# EAGLE schematic system (EAGLE 7.4.0)
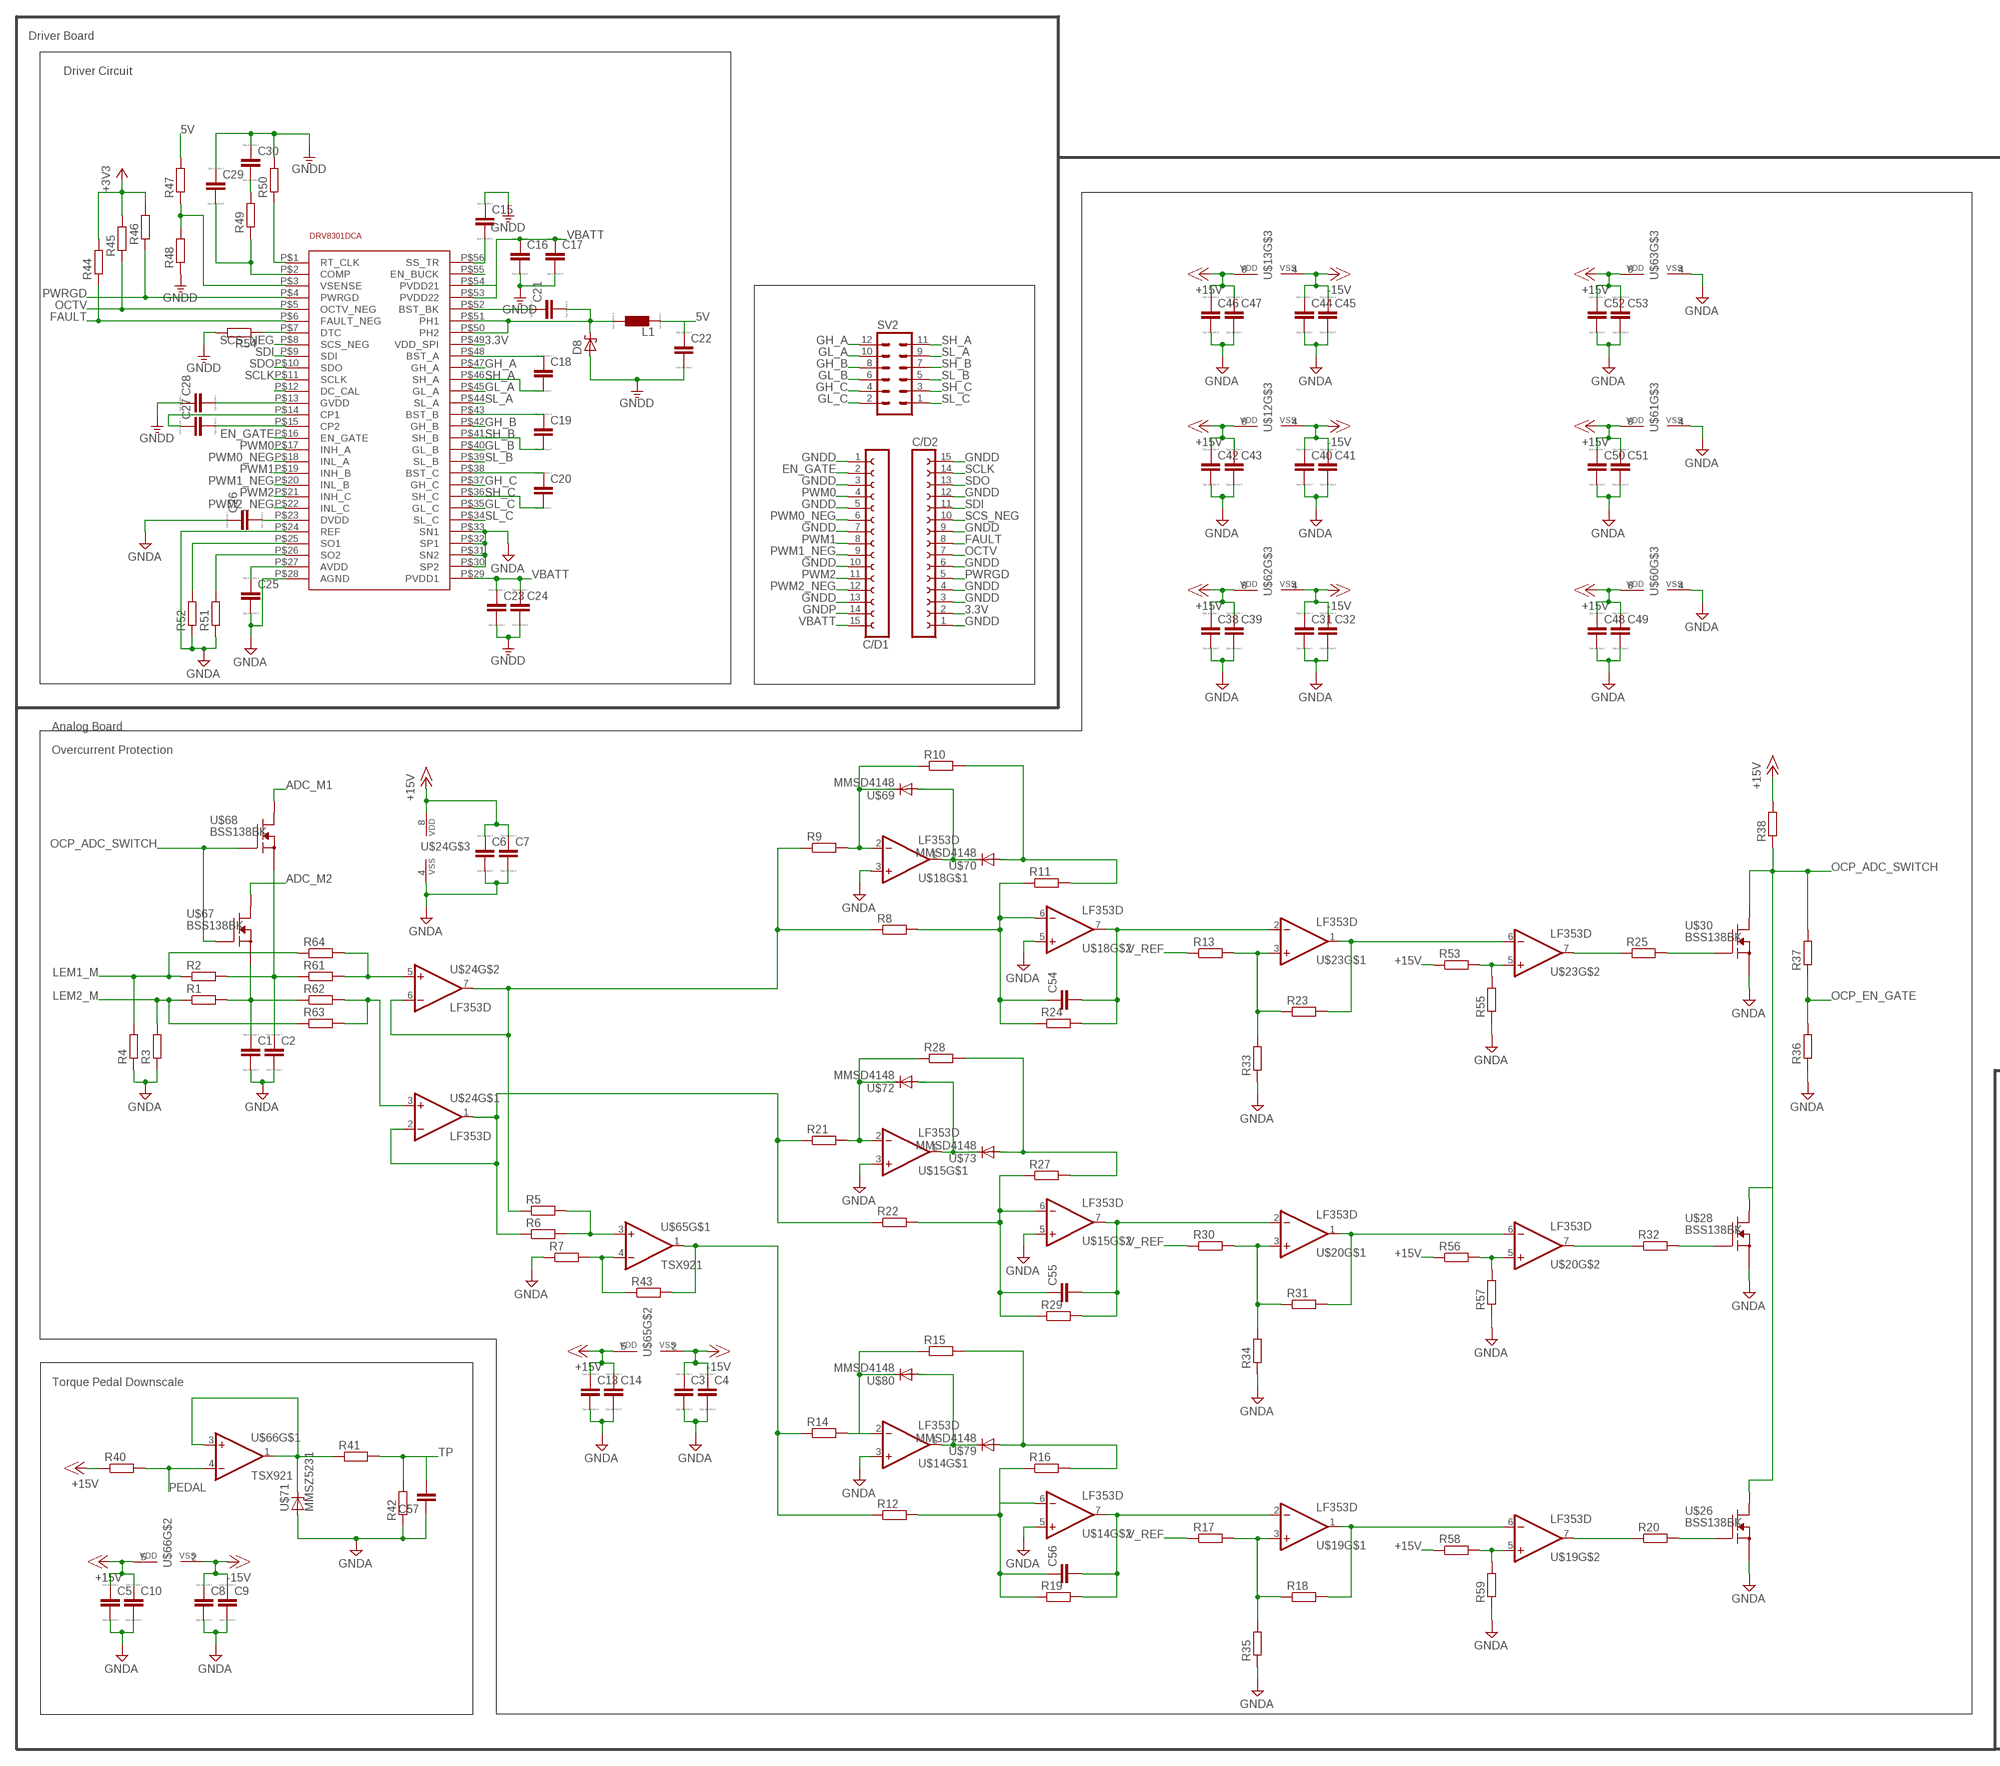
[diagram p0: schematic, sheet 1, part 1 of 2]
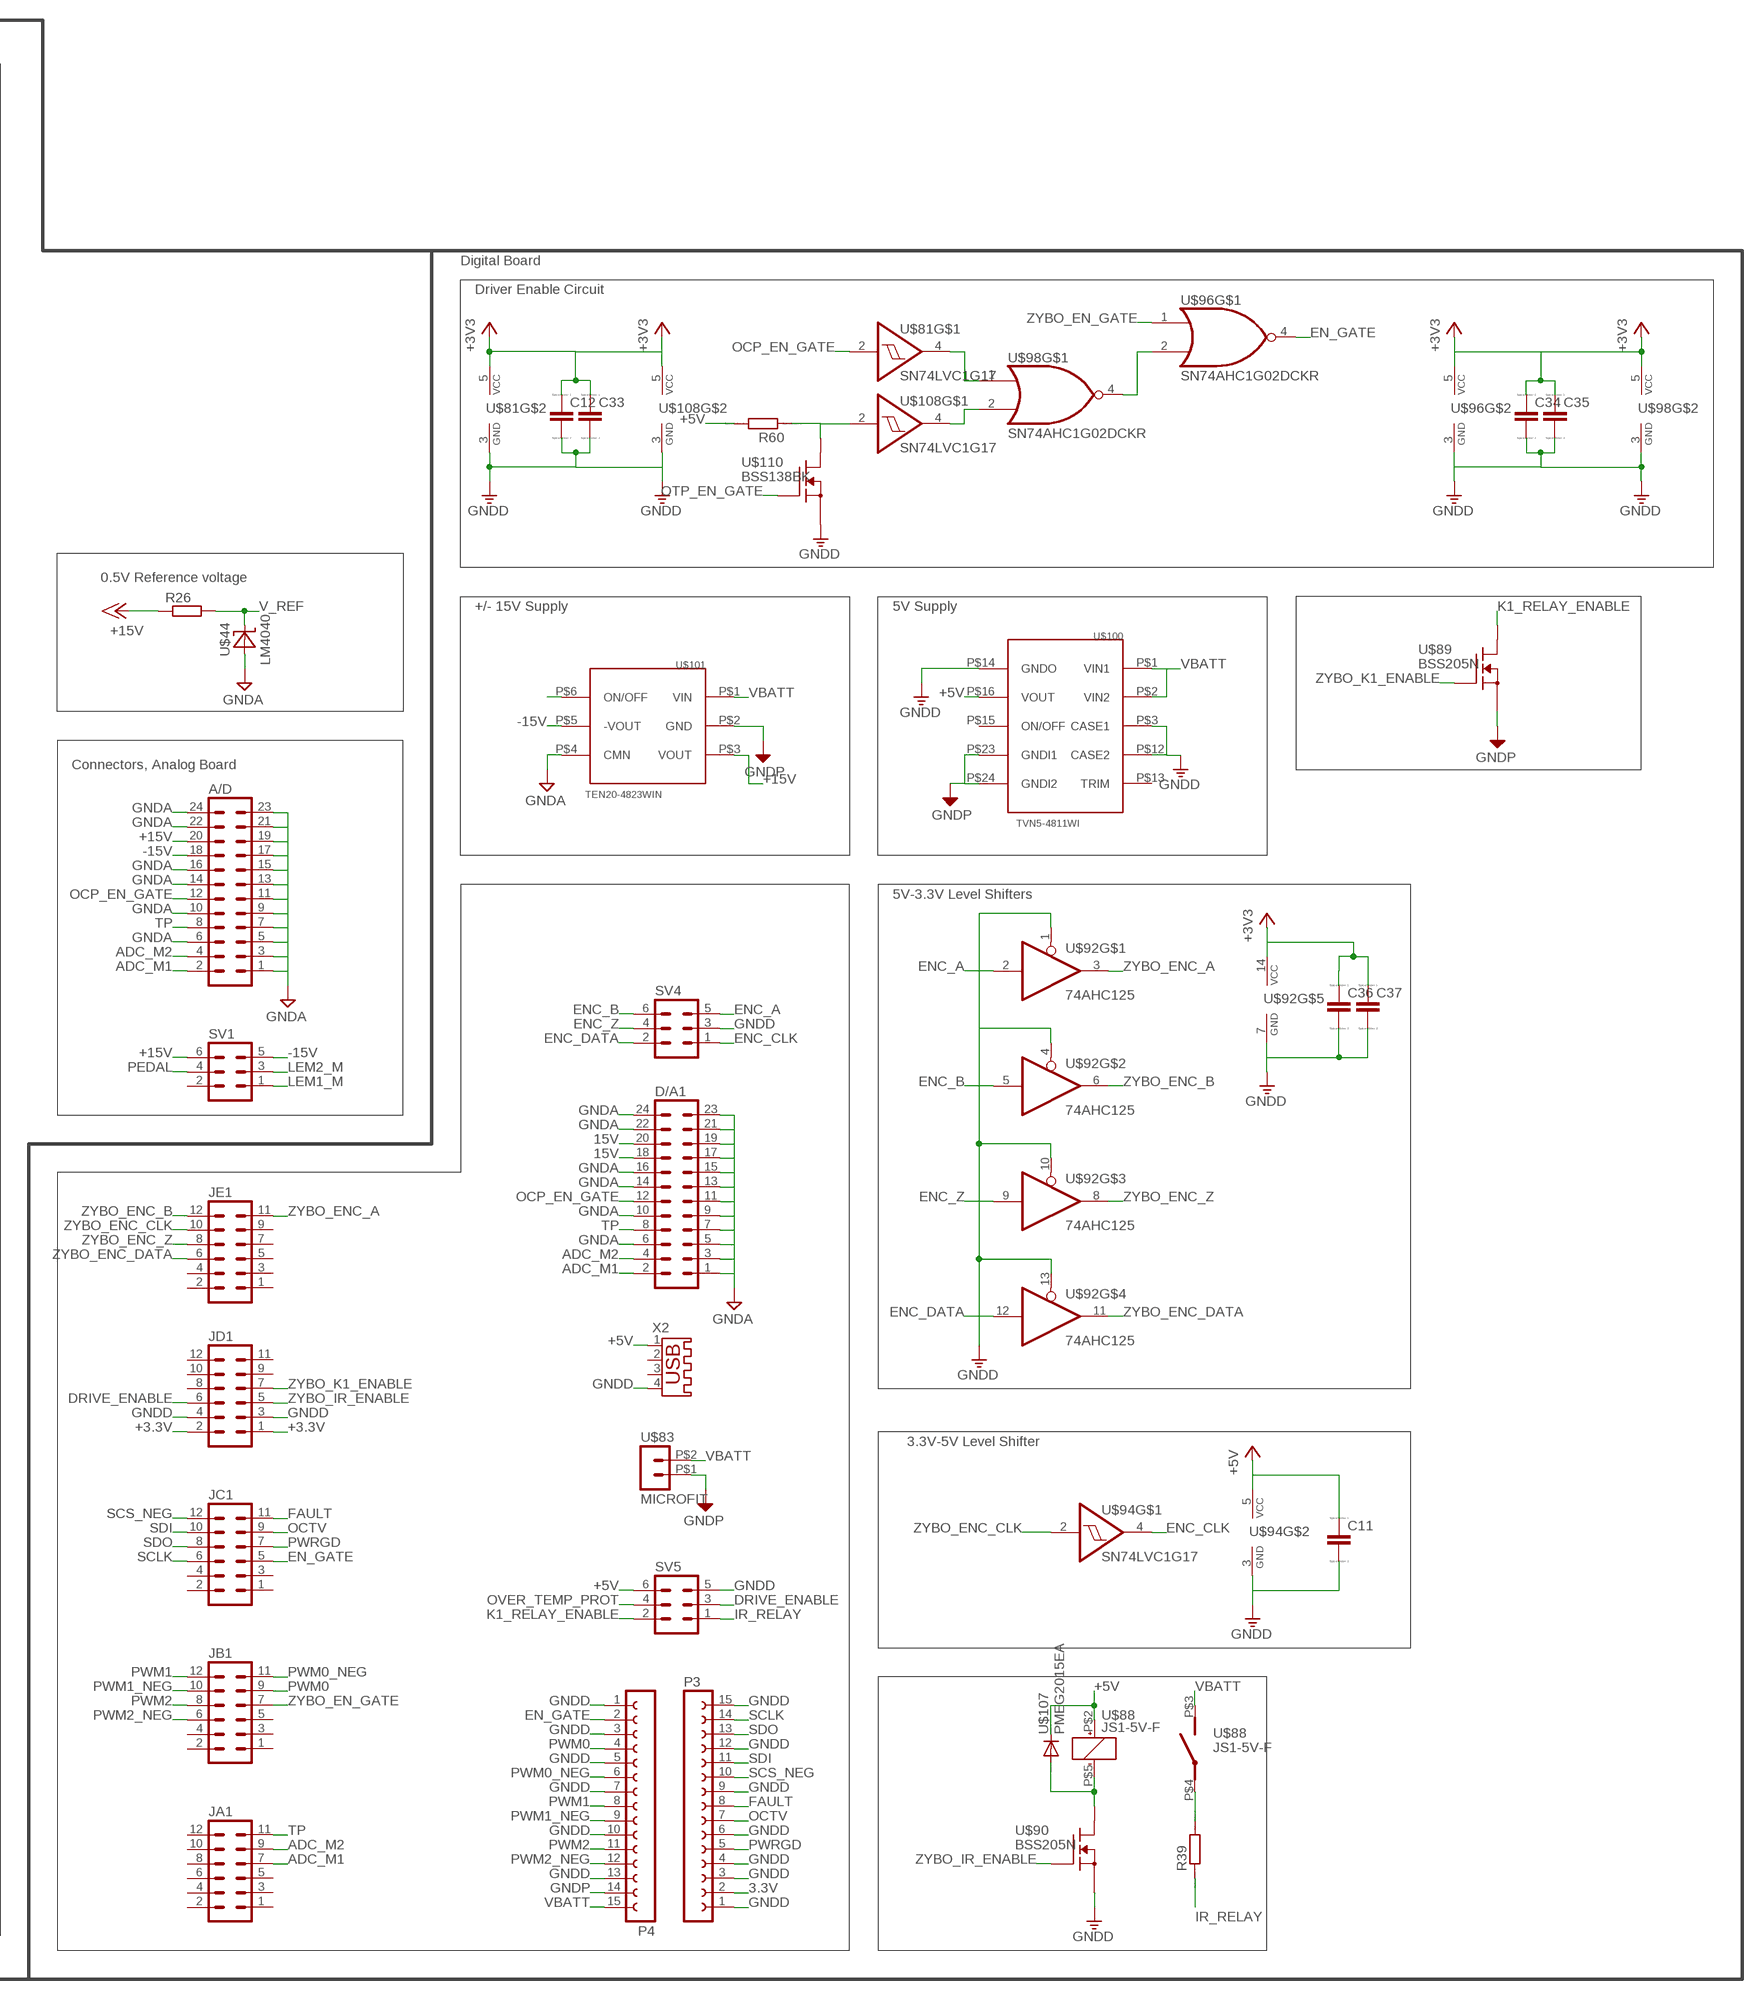
[diagram p1: schematic, sheet 1, part 2 of 2]

## Parts
A/D  MA12-2  [MA12-2]
C1  CC1206  [C1206]
C2  CC1206  [C1206]
C3  CC1206  [C1206]
C4  CC1206  [C1206]
C5  CC1206  [C1206]
C6  CC1206  [C1206]
C7  CC1206  [C1206]
C8  CC1206  [C1206]
C9  CC1206  [C1206]
C10  CC1206  [C1206]
C11  CC1206  [C1206]
C12  CC1206  [C1206]
C13  CC1206  [C1206]
C14  CC1206  [C1206]
C15  CC1206  [C1206]
C16  CC1206  [C1206]
C17  CC1206  [C1206]
C18  CC1206  [C1206]
C19  CC1206  [C1206]
C20  CC1206  [C1206]
C21  CC1206  [C1206]
C22  CC1206  [C1206]
C23  CC1206  [C1206]
C24  CC1206  [C1206]
C25  CC1206  [C1206]
C26  CC1206  [C1206]
C27  CC1206  [C1206]
C28  CC1206  [C1206]
C29  CC1206  [C1206]
C30  CC1206  [C1206]
C31  CC1206  [C1206]
C32  CC1206  [C1206]
C33  CC1206  [C1206]
C34  CC1206  [C1206]
C35  CC1206  [C1206]
C36  CC1206  [C1206]
C37  CC1206  [C1206]
C38  CC1206  [C1206]
C39  CC1206  [C1206]
C40  CC1206  [C1206]
C41  CC1206  [C1206]
C42  CC1206  [C1206]
C43  CC1206  [C1206]
C44  CC1206  [C1206]
C45  CC1206  [C1206]
C46  CC1206  [C1206]
C47  CC1206  [C1206]
C48  CC1206  [C1206]
C49  CC1206  [C1206]
C50  CC1206  [C1206]
C51  CC1206  [C1206]
C52  CC1206  [C1206]
C53  CC1206  [C1206]
C54  C-EUC0805  [C0805]
C55  C-EUC0805  [C0805]
C56  C-EUC0805  [C0805]
C57  C-EUC0805  [C0805]
C/D1  FE15-1  [FE15]
C/D2  FE15-1  [FE15]
D8  SCHOTTKY-DIODESMD  [SMB]
D/A1  MA12-2  [MA12-2]
JA1  MA06-2  [MA06-2]
JB1  MA06-2  [MA06-2]
JC1  MA06-2  [MA06-2]
JD1  MA06-2  [MA06-2]
JE1  MA06-2  [MA06-2]
L1  L  [L1812]
P3  FE15-1  [FE15]
P4  FE15-1  [FE15]
R1  R-EU_M0805  [M0805]
R2  R-EU_M0805  [M0805]
R3  R-EU_M0805  [M0805]
R4  R-EU_M0805  [M0805]
R5  R-EU_M0805  [M0805]
R6  R-EU_M0805  [M0805]
R7  R-EU_M0805  [M0805]
R8  R-EU_M0805  [M0805]
R9  R-EU_M0805  [M0805]
R10  R-EU_M0805  [M0805]
R11  R-EU_M0805  [M0805]
R12  R-EU_M0805  [M0805]
R13  R-EU_M0805  [M0805]
R14  R-EU_M0805  [M0805]
R15  R-EU_M0805  [M0805]
R16  R-EU_M0805  [M0805]
R17  R-EU_M0805  [M0805]
R18  R-EU_M0805  [M0805]
R19  R-EU_M0805  [M0805]
R20  R-EU_M0805  [M0805]
R21  R-EU_M0805  [M0805]
R22  R-EU_M0805  [M0805]
R23  R-EU_M0805  [M0805]
R24  R-EU_M0805  [M0805]
R25  R-EU_M0805  [M0805]
R26  R-EU_M0805  [M0805]
R27  R-EU_M0805  [M0805]
R28  R-EU_M0805  [M0805]
R29  R-EU_M0805  [M0805]
R30  R-EU_M0805  [M0805]
R31  R-EU_M0805  [M0805]
R32  R-EU_M0805  [M0805]
R33  R-EU_M0805  [M0805]
R34  R-EU_M0805  [M0805]
R35  R-EU_M0805  [M0805]
R36  R-EU_M0805  [M0805]
R37  R-EU_M0805  [M0805]
R38  R-EU_M0805  [M0805]
R39  RR1206  [R1206]
R40  R-EU_M0805  [M0805]
R41  R-EU_M0805  [M0805]
R42  R-EU_M0805  [M0805]
R43  R-EU_M0805  [M0805]
R44  R-EU_R1206  [R1206]
R45  R-EU_R1206  [R1206]
R46  R-EU_R1206  [R1206]
R47  R-EU_R1206  [R1206]
R48  R-EU_R1206  [R1206]
R49  R-EU_R1206  [R1206]
R50  R-EU_R1206  [R1206]
R51  R-EU_R1206  [R1206]
R52  R-EU_R1206  [R1206]
R53  R-EU_M0805  [M0805]
R54  R-EU_R1206  [R1206]
R55  R-EU_M0805  [M0805]
R56  R-EU_M0805  [M0805]
R57  R-EU_M0805  [M0805]
R58  R-EU_M0805  [M0805]
R59  R-EU_M0805  [M0805]
R60  RR1206  [R1206]
R61  R-EU_M0805  [M0805]
R62  R-EU_M0805  [M0805]
R63  R-EU_M0805  [M0805]
R64  R-EU_M0805  [M0805]
SV1  MA03-2  [MA03-2]
SV2  MA06-2  [MA06-2]
SV4  MA03-2  [MA03-2]
SV5  MA03-2  [MA03-2]
U$12  LF353D  [SO08]
U$13  LF353D  [SO08]
U$14  LF353D  [SO08]
U$15  LF353D  [SO08]
U$18  LF353D  [SO08]
U$19  LF353D  [SO08]
U$20  LF353D  [SO08]
U$23  LF353D  [SO08]
U$24  LF353D  [SO08]
U$26  BSS138BK  [SOT23]
U$28  BSS138BK  [SOT23]
U$29  DRV8301DCA  [HTSSOP-56]
U$30  BSS138BK  [SOT23]
U$44  LM4040  [SOT23]
U$60  LF353D  [SO08]
U$61  LF353D  [SO08]
U$62  LF353D  [SO08]
U$63  LF353D  [SO08]
U$65  TSX921  [SOT23-5]
U$66  TSX921  [SOT23-5]
U$67  BSS138BK  [SOT23]
U$68  BSS138BK  [SOT23]
U$69  MMSD4148  [SOD123]
U$70  MMSD4148  [SOD123]
U$71  MMSZ5231  [SOD123]
U$72  MMSD4148  [SOD123]
U$73  MMSD4148  [SOD123]
U$79  MMSD4148  [SOD123]
U$80  MMSD4148  [SOD123]
U$81  SN74LVC1G17  [SOT23-5L]
U$83  MICROFIT  [MICROFIT-3.0]
U$88  JS1-5V-F  [JS1-5V-F]
U$89  BSS205N  [SOT23]
U$90  BSS205N  [SOT23]
U$92  74AHC125  [SO14]
U$94  SN74LVC1G17  [SOT23-5L]
U$96  SN74AHC1G02DCKR  [SOT23-5]
U$98  SN74AHC1G02DCKR  [SOT23-5]
U$100  TVN5-4811WI  [DIP24]
U$101  TEN20-4823WIN  [TEN20-4823]
U$107  PMEG2015EA  [SOD323_ST]
U$108  SN74LVC1G17  [SOT23-5L]
U$110  BSS138BK  [SOT23]
X2  USB-A003  [USB-A003]

## Nets
3.3V: C/D2.2 P3.2 U$29.P$49(VDD_SPI)
5V: C22.1 L1.2 R47.2
15V: D/A1.18 D/A1.20
+3.3V: JD1.1 JD1.2
+3V3: C12.1 C33.1 C34.1 C35.1 C36.1 C37.1 R44.2 R45.2 R46.2 U$81.5(VCC) U$92.14(VCC) U$96.5(VCC) U$98.5(VCC) U$108.5(VCC)
+5V: C11.1 R60.2 SV5.6 U$88.P$2(+) U$94.5(VCC) U$100.P$16(VOUT) U$107.C X2.1
+15V: A/D.20 C5.1 C6.1 C7.1 C10.1 C13.1 C14.1 C38.1 C39.1 C42.1 C43.1 C46.1 C47.1 C48.1 C49.1 C50.1 C51.1 C52.1 C53.1 R26.1 R38.2 R40.1 R53.1 R56.1 R58.1 SV1.6 U$12.8(VDD) U$13.8(VDD) U$24.8(VDD) U$60.8(VDD) U$61.8(VDD) U$62.8(VDD) U$63.8(VDD) U$65.5(VDD) U$66.5(VDD) U$101.P$3(VOUT)
-15V: A/D.18 C3.1 C4.1 C8.1 C9.1 C31.1 C32.1 C40.1 C41.1 C44.1 C45.1 SV1.5 U$12.4(VSS) U$13.4(VSS) U$62.4(VSS) U$65.2(VSS) U$66.2(VSS) U$101.P$5(-VOUT)
ADC_M1: A/D.2 D/A1.2 JA1.7 U$68.3(D)
ADC_M2: A/D.4 D/A1.4 JA1.9 U$67.3(D)
DRIVE_ENABLE: JD1.6 SV5.3
EN_GATE: C/D1.2 JC1.5 P4.2 U$29.P$16(EN_GATE) U$96.4(O)
ENC_A: SV4.5 U$92.2(I)
ENC_B: SV4.6 U$92.5(I)
ENC_CLK: SV4.1 U$94.4(O)
ENC_DATA: SV4.2 U$92.12(I)
ENC_Z: SV4.4 U$92.9(I)
FAULT: C/D2.8 JC1.11 P3.8 R44.1 U$29.P$6(FAULT_NEG)
GH_A: SV2.12 U$29.P$47(GH_A)
GH_B: SV2.8 U$29.P$42(GH_B)
GH_C: SV2.4 U$29.P$37(GH_C)
GL_A: SV2.10 U$29.P$45(GL_A)
GL_B: SV2.6 U$29.P$40(GL_B)
GL_C: SV2.2 U$29.P$35(GL_C)
GNDA: A/D.1 A/D.3 A/D.5 A/D.6 A/D.7 A/D.9 A/D.10 A/D.11 A/D.13 A/D.14 A/D.15 A/D.16 A/D.22 A/D.23 A/D.24 C1.2 C2.2 C3.2 C4.2 C5.2 C6.2 C7.2 C8.2 C9.2 C10.2 C13.2 C14.2 C25.2 C26.1 C31.2 C32.2 C38.2 C39.2 C40.2 C41.2 C42.2 C43.2 C44.2 C45.2 C46.2 C47.2 C48.2 C49.2 C50.2 C51.2 C52.2 C53.2 C57.1 D/A1.1 D/A1.3 D/A1.5 D/A1.6 D/A1.7 D/A1.9 D/A1.10 D/A1.11 D/A1.13 D/A1.14 D/A1.15 D/A1.16 D/A1.22 D/A1.23 D/A1.24 R3.1 R4.1 R7.1 R33.1 R34.1 R35.1 R36.1 R42.1 R51.1 R52.1 R55.1 R57.1 R59.1 U$14.3(+IN) U$14.5(+IN) U$15.3(+IN) U$15.5(+IN) U$18.3(+IN) U$18.5(+IN) U$24.4(VSS) U$26.2(S) U$28.2(S) U$29.P$24(REF) U$29.P$28(AGND) U$29.P$30(SP2) U$29.P$31(SN2) U$29.P$32(SP1) U$29.P$33(SN1) U$30.2(S) U$44.1(A) U$60.4(VSS) U$61.4(VSS) U$63.4(VSS) U$71.A U$101.P$4(CMN)
GNDD: C11.2 C12.2 C15.1 C16.2 C17.2 C22.2 C23.2 C24.2 C28.1 C29.1 C30.1 C33.2 C34.2 C35.2 C36.2 C37.2 C/D1.1 C/D1.3 C/D1.5 C/D1.7 C/D1.10 C/D1.13 C/D2.1 C/D2.3 C/D2.4 C/D2.6 C/D2.9 C/D2.12 C/D2.15 D8.A JD1.3 JD1.4 P3.1 P3.3 P3.4 P3.6 P3.9 P3.12 P3.15 P4.1 P4.3 P4.5 P4.7 P4.10 P4.13 R48.1 R50.2 R54.2 SV4.3 SV5.5 U$81.3(GND) U$90.2(S) U$92.1(OE) U$92.4(OE) U$92.7(GND) U$92.10(OE) U$92.13(OE) U$94.3(GND) U$96.3(GND) U$98.3(GND) U$100.P$3(CASE1) U$100.P$12(CASE2) U$100.P$14(GNDO) U$108.3(GND) U$110.2(S) X2.4
GNDP: C/D1.14 P4.14 U$83.P$1 U$89.2(S) U$100.P$23(GNDI1) U$100.P$24(GNDI2) U$101.P$2(GND)
IR_RELAY: R39.1 SV5.1
K1_RELAY_ENABLE: SV5.2 U$89.3(D)
LEM1_M: R2.1 R4.2 R64.1 SV1.1
LEM2_M: R1.1 R3.2 R63.1 SV1.3
N$1: U$24.3(+IN)
N$2: R5.1 R8.1 R9.1 U$24.6(-IN) U$24.7(OUT)
N$3: R9.2 R10.1 U$18.2(-IN) U$69.C
N$4: R62.2 R63.2
N$5: R13.2 R23.1 R33.2 U$23.3(+IN)
N$6: R5.2 R6.2 U$65.3(+IN)
N$7: R12.1 R14.1 R43.2 U$65.1(OUT)
N$8: C54.1 R8.2 R11.1 R24.1 U$18.6(-IN)
N$9: R10.2 R11.2 U$70.A
N$10: C54.2 R24.2 U$18.7(OUT) U$23.2(-IN)
N$11: U$18.1(OUT) U$69.A U$70.C
N$12: R6.1 R21.1 R22.1 U$24.1(OUT) U$24.2(-IN)
N$13: R14.2 R15.1 U$14.2(-IN) U$80.C
N$14: C56.1 R12.2 R16.1 R19.1 U$14.6(-IN)
N$15: U$14.1(OUT) U$79.C U$80.A
N$16: R15.2 R16.2 U$79.A
N$17: C56.2 R19.2 U$14.7(OUT) U$19.2(-IN)
N$18: R23.2 U$23.1(OUT) U$23.6(-IN)
N$19: R17.2 R18.1 R35.2 U$19.3(+IN)
N$20: R18.2 U$19.1(OUT) U$19.6(-IN)
N$21: R53.2 R55.2 U$23.5(+IN)
N$22: R7.2 R43.1 U$65.4(-IN)
N$23: R21.2 R28.1 U$15.2(-IN) U$72.C
N$24: C55.1 R22.2 R27.1 R29.1 U$15.6(-IN)
N$25: U$15.1(OUT) U$72.A U$73.C
N$26: R27.2 R28.2 U$73.A
N$27: C55.2 R29.2 U$15.7(OUT) U$20.2(-IN)
N$28: A/D.21
N$29: R30.2 R31.1 R34.2 U$20.3(+IN)
N$30: R31.2 U$20.1(OUT) U$20.6(-IN)
N$31: R56.2 R57.2 U$20.5(+IN)
N$32: R25.1 U$23.7(OUT)
N$33: R25.2 U$30.1(G)
N$34: R32.2 U$28.1(G)
N$35: R20.2 U$26.1(G)
N$36: A/D.19
N$37: R41.1 U$66.1(OUT) U$66.3(+IN) U$71.C
N$38: D/A1.21
N$39: D/A1.19
N$40: R58.2 R59.2 U$19.5(+IN)
N$41: R50.1 U$29.P$1(RT_CLK)
N$42: R32.1 U$20.7(OUT)
N$43: A/D.17
N$44: U$29.P$12(DC_CAL)
N$45: D/A1.17
N$46: R20.1 U$19.7(OUT)
N$47: C28.2 U$29.P$13(GVDD)
N$48: C27.1 U$29.P$14(CP1)
N$49: C27.2 U$29.P$15(CP2)
N$50: C26.2 U$29.P$23(DVDD)
N$51: R52.2 U$29.P$25(SO1)
N$52: R51.2 U$29.P$26(SO2)
N$53: C25.1 U$29.P$27(AVDD)
N$54: C20.1 U$29.P$38(BST_C)
N$55: C19.1 U$29.P$43(BST_B)
N$56: C18.1 U$29.P$48(BST_A)
N$57: C21.2 D8.C L1.1 U$29.P$50(PH2) U$29.P$51(PH1)
N$58: C21.1 U$29.P$52(BST_BK)
N$59: U$29.P$55(EN_BUCK)
N$60: R47.1 R48.2 U$29.P$3(VSENSE)
N$61: C30.2 R49.2
N$62: C15.2 U$29.P$56(SS_TR)
N$63: C29.2 R49.1 U$29.P$2(COMP)
N$64: R39.2 U$88.P$4(P)
N$65: R54.1 U$29.P$7(DTC)
N$66: U$81.4(O) U$98.1(I0)
N$67: U$88.P$5(-) U$90.3(D) U$107.A
N$68: U$101.P$6(ON/OFF)
N$69: U$98.2(I1) U$108.4(O)
N$70: U$96.2(I1) U$98.4(O)
N$71: R60.1 U$108.2(I) U$110.3(D)
N$72: C2.1 R2.2 R61.1 U$68.2(S)
N$73: R61.2 R64.2 U$24.5(+IN)
N$74: C1.1 R1.2 R62.1 U$67.2(S)
OCP_ADC_SWITCH: R37.2 R38.1 U$26.3(D) U$28.3(D) U$30.3(D) U$67.1(G) U$68.1(G)
OCP_EN_GATE: A/D.12 D/A1.12 R36.2 R37.1 U$81.2(I)
OCTV: C/D2.7 JC1.9 P3.7 R45.1 U$29.P$5(OCTV_NEG)
OTP_EN_GATE: U$110.1(G)
OVER_TEMP_PROT: SV5.4
PEDAL: R40.2 SV1.4 U$66.4(-IN)
PWM0: C/D1.4 JB1.9 P4.4 U$29.P$17(INH_A)
PWM0_NEG: C/D1.6 JB1.11 P4.6 U$29.P$18(INL_A)
PWM1: C/D1.8 JB1.12 P4.8 U$29.P$19(INH_B)
PWM1_NEG: C/D1.9 JB1.10 P4.9 U$29.P$20(INL_B)
PWM2: C/D1.11 JB1.8 P4.11 U$29.P$21(INH_C)
PWM2_NEG: C/D1.12 JB1.6 P4.12 U$29.P$22(INL_C)
PWRGD: C/D2.5 JC1.7 P3.5 R46.1 U$29.P$4(PWRGD)
SCLK: C/D2.14 JC1.6 P3.14 U$29.P$11(SCLK)
SCS_NEG: C/D2.10 JC1.12 P3.10 U$29.P$8(SCS_NEG)
SDI: C/D2.11 JC1.10 P3.11 U$29.P$9(SDI)
SDO: C/D2.13 JC1.8 P3.13 U$29.P$10(SDO)
SH_A: C18.2 SV2.11 U$29.P$46(SH_A)
SH_B: C19.2 SV2.7 U$29.P$41(SH_B)
SH_C: C20.2 SV2.3 U$29.P$36(SH_C)
SL_A: SV2.9 U$29.P$44(SL_A)
SL_B: SV2.5 U$29.P$39(SL_B)
SL_C: SV2.1 U$29.P$34(SL_C)
TP: A/D.8 C57.2 D/A1.8 JA1.11 R41.2 R42.2
V_REF: R13.1 R17.1 R26.2 R30.1 U$44.2(C)
VBATT: C16.1 C17.1 C23.1 C24.1 C/D1.15 P4.15 U$29.P$29(PVDD1) U$29.P$53(PVDD22) U$29.P$54(PVDD21) U$83.P$2 U$88.P$3(S) U$100.P$1(VIN1) U$100.P$2(VIN2) U$101.P$1(VIN)
ZYBO_EN_GATE: JB1.7 U$96.1(I0)
ZYBO_ENC_A: JE1.11 U$92.3(O)
ZYBO_ENC_B: JE1.12 U$92.6(O)
ZYBO_ENC_CLK: JE1.10 U$94.2(I)
ZYBO_ENC_DATA: JE1.6 U$92.11(O)
ZYBO_ENC_Z: JE1.8 U$92.8(O)
ZYBO_IR_ENABLE: JD1.5 U$90.1(G)
ZYBO_K1_ENABLE: JD1.7 U$89.1(G)
Unconnected: JA1.1 JA1.2 JA1.3 JA1.4 JA1.5 JA1.6 JA1.8 JA1.10 JA1.12 JB1.1 JB1.2 JB1.3 JB1.4 JB1.5 JC1.1 JC1.2 JC1.3 JC1.4 JD1.8 JD1.9 JD1.10 JD1.11 JD1.12 JE1.1 JE1.2 JE1.3 JE1.4 JE1.5 JE1.7 JE1.9 SV1.2 U$12.1(OUT) U$12.2(-IN) U$12.3(+IN) U$12.5(+IN) U$12.6(-IN) U$12.7(OUT) U$13.1(OUT) U$13.2(-IN) U$13.3(+IN) U$13.5(+IN) U$13.6(-IN) U$13.7(OUT) U$60.1(OUT) U$60.2(-IN) U$60.3(+IN) U$60.5(+IN) U$60.6(-IN) U$60.7(OUT) U$61.1(OUT) U$61.2(-IN) U$61.3(+IN) U$61.5(+IN) U$61.6(-IN) U$61.7(OUT) U$62.1(OUT) U$62.2(-IN) U$62.3(+IN) U$62.5(+IN) U$62.6(-IN) U$62.7(OUT) U$63.1(OUT) U$63.2(-IN) U$63.3(+IN) U$63.5(+IN) U$63.6(-IN) U$63.7(OUT) U$100.P$13(TRIM) U$100.P$15(ON/OFF) X2.2 X2.3

## Notes on the sheet
- Driver Board
- Driver Circuit
- Digital Board
- Driver Enable Circuit
- 0.5V Reference voltage
- +/- 15V Supply | 5V Supply
- Analog Board
- Overcurrent Protection
- Connectors, Analog Board
- 5V-3.3V Level Shifters
- 3.3V-5V Level Shifter
- Torque Pedal Downscale

## Power pins joined to a net without a drawn wire
VDD: U$14.8(VDD) U$15.8(VDD) U$18.8(VDD) U$19.8(VDD) U$20.8(VDD) U$23.8(VDD)
VSS: U$14.4(VSS) U$15.4(VSS) U$18.4(VSS) U$19.4(VSS) U$20.4(VSS) U$23.4(VSS)

## Library data of the parts
A/D D/A1 = con-lstb:MA12-2: PIN HEADER; OC_FARNELL: unknown; OC_NEWARK: unknown
C1-C53 = eagle-ltspice:C: CAPACITOR, European symbol; SPICEMODEL: NONE; SPICEPREFIX: C
C54-C57 = rcl:C-EU: CAPACITOR, European symbol
C/D1 C/D2 P3 P4 = con-lsta:FE15-1: FEMALE HEADER; OC_FARNELL: unknown; OC_NEWARK: unknown
D8 = diode:SCHOTTKY-DIODE: Schottky Diode
JA1 JB1 JC1 JD1 JE1 SV2 = con-lstb:MA06-2: PIN HEADER; OC_FARNELL: unknown; OC_NEWARK: unknown
L1 = eagle-ltspice:L: INDUCTOR, European symbol; SPICEMODEL: NONE; SPICEPREFIX: L
R1-R38 R40-R59 R61-R64 = rcl:R-EU_: RESISTOR, European symbol
R39 R60 = eagle-ltspice:R: RESISTOR, European symbol; SPICEMODEL: NONE; SPICEPREFIX: R
SV1 SV4 SV5 = con-lstb:MA03-2: PIN HEADER; OC_FARNELL: unknown; OC_NEWARK: unknown
U$12-U$15 U$18-U$20 U$23 U$24 U$60-U$63 = custom_parts:LF353D
U$26 U$28 U$30 U$67 U$68 U$110 = custom_parts:BSS138BK
U$29 = custom_parts:DRV8301DCA
U$44 = custom_parts:LM4040
U$65 U$66 = custom_parts:TSX921
U$69 U$70 U$72 U$73 U$79 U$80 = custom_parts:MMSD4148
U$71 = custom_parts:MMSZ5231
U$81 U$94 U$108 = custom_parts:SN74LVC1G17
U$83 = custom_parts:MICROFIT
U$88 = custom_parts:JS1-5V-F
U$89 U$90 = custom_parts:BSS205N
U$92 = custom_parts:74AHC125
U$96 U$98 = custom_parts:SN74AHC1G02DCKR
U$100 = custom_parts:TVN5-4811WI
U$101 = custom_parts:TEN20-4823WIN
U$107 = custom_parts:PMEG2015EA
X2 = con-yamaichi:USB-A003: USB connector; OC_FARNELL: unknown; OC_NEWARK: unknown